# Altium schematic sheet modulo_temperatura.SchDoc
size A4; SheetNumber: 1; SheetTotal: 1
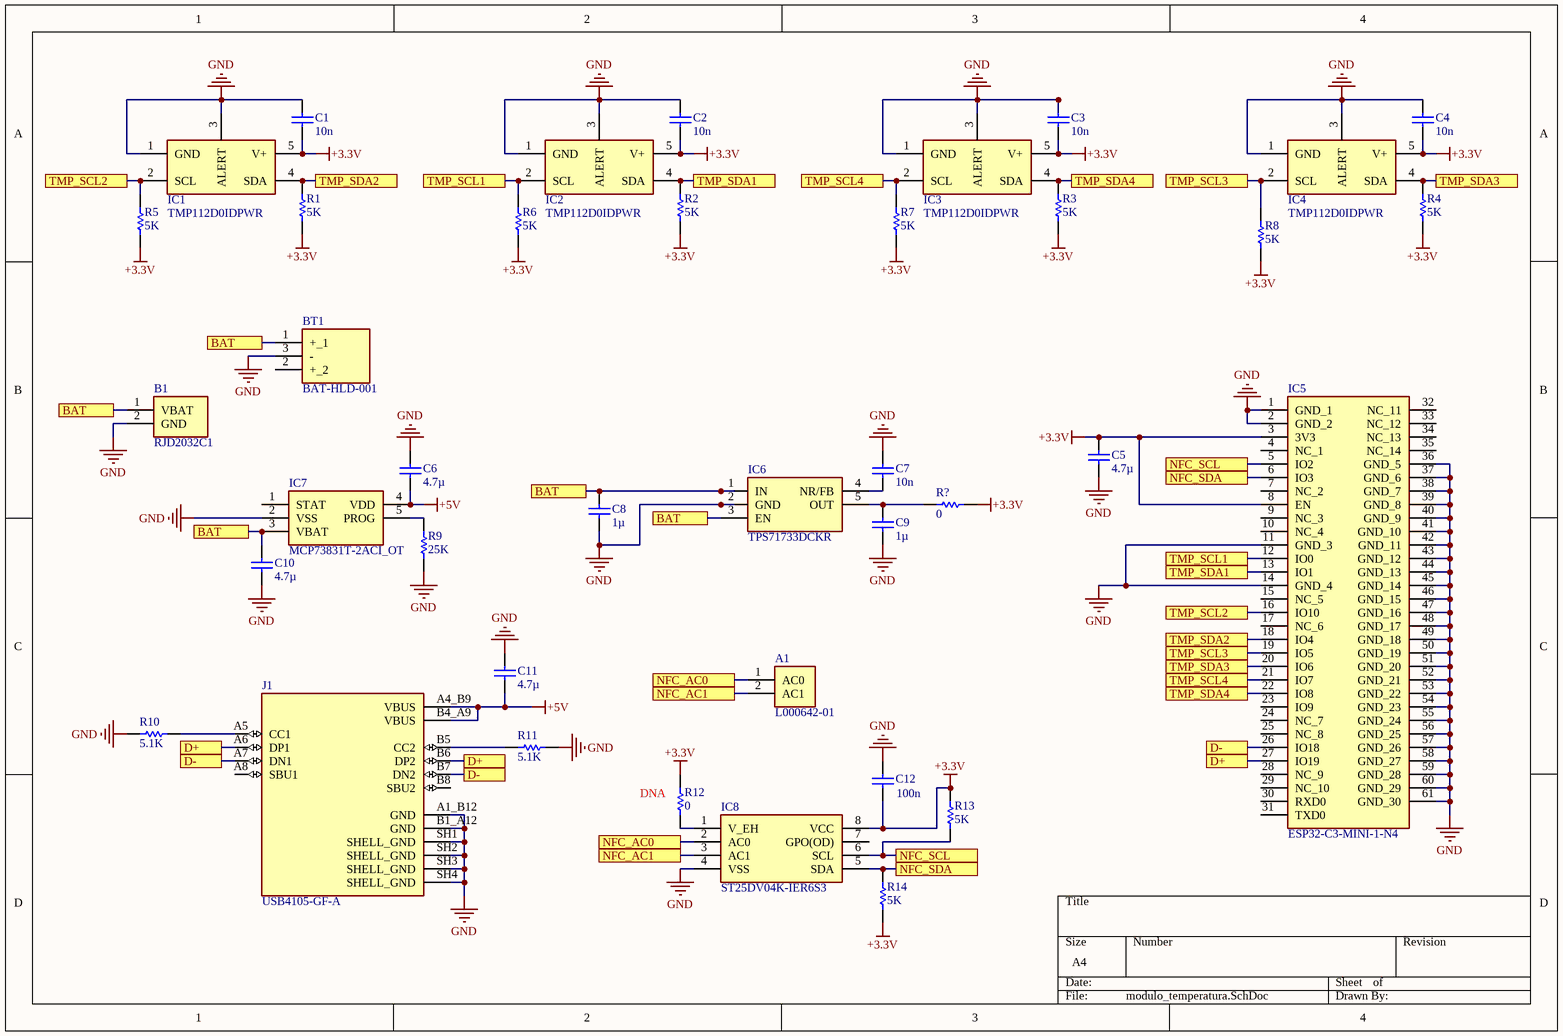
[diagram p0: modulo_temperatura.SchDoc]

## Parts
A1  L000642-01
B1  RJD2032C1
BT1  BAT-HLD-001  [BATHLD001]
C1  value 10n  (hidden comment: Capacitor)
C2  value 10n  (hidden comment: Capacitor)
C3  value 10n  (hidden comment: Capacitor)
C4  value 10n  (hidden comment: Capacitor)
C5  value 4.7µ  (hidden comment: Capacitor)
C6  value 4.7µ  (hidden comment: Capacitor)
C7  value 10n  (hidden comment: Capacitor)
C8  value 1µ  (hidden comment: Capacitor)
C9  value 1µ  (hidden comment: Capacitor)
C10  value 4.7µ  (hidden comment: Capacitor)
C11  value 4.7µ  (hidden comment: Capacitor)
C12  value 100n  (hidden comment: Capacitor)
IC1  TMP112D0IDPWR
IC2  TMP112D0IDPWR
IC3  TMP112D0IDPWR
IC4  TMP112D0IDPWR
IC5  ESP32-C3-MINI-1-N4  [ESP32C3MINI1N4]
IC6  TPS71733DCKR  [SOT65P210X110-5N]
IC7  MCP73831T-2ACI_OT  [SOT95P270X145-5N]
IC8  ST25DV04K-IER6S3  [SOIC127P600X175-8N]
J1  USB4105-GF-A  [GCT_USB4105-GF-A]
R1  value 5K  (hidden comment: Resistor)
R2  value 5K  (hidden comment: Resistor)
R3  value 5K  (hidden comment: Resistor)
R4  value 5K  (hidden comment: Resistor)
R5  value 5K  (hidden comment: Resistor)
R6  value 5K  (hidden comment: Resistor)
R7  value 5K  (hidden comment: Resistor)
R8  value 5K  (hidden comment: Resistor)
R9  value 25K  (hidden comment: Resistor)
R10  value 5.1K  (hidden comment: Resistor)
R11  value 5.1K  (hidden comment: Resistor)
R12  value 0  (hidden comment: Resistor)
R13  value 5K  (hidden comment: Resistor)
R14  value 5K  (hidden comment: Resistor)
R?  value 0  (hidden comment: Resistor)

## Ports
BAT, D+, D-, NFC_AC0, NFC_AC1, NFC_SCL, NFC_SDA, TMP_SCL1, TMP_SCL2, TMP_SCL3, TMP_SCL4, TMP_SDA1, TMP_SDA2, TMP_SDA3, TMP_SDA4

## Nets
+3.3V: C1.1 C2.1 C3.1 C4.1 C5.2 C12.1 IC1.5(V+) IC2.5(V+) IC3.5(V+) IC4.5(V+) IC5.3(3V3) IC5.8(EN) IC8.8(VCC) R1.1 R2.1 R3.1 R4.1 R5.1 R6.1 R7.1 R8.1 R12.1 R13.1 R14.1 R?.2
+5V: C6.1 C11.2 IC7.4(VDD) J1.A4_B9(VBUS) J1.B4_A9(VBUS)
GND: B1.2(GND) BT1.3(-) C1.2 C2.2 C3.2 C4.2 C5.1 C6.2 C7.2 C8.1 C9.1 C10.1 C11.1 C12.2 IC1.1(GND) IC1.3(ALERT) IC2.1(GND) IC2.3(ALERT) IC3.1(GND) IC3.3(ALERT) IC4.1(GND) IC4.3(ALERT) IC5.1(GND_1) IC5.2(GND_2) IC5.11(GND_3) IC5.14(GND_4) IC5.36(GND_5) IC5.37(GND_6) IC5.38(GND_7) IC5.39(GND_8) IC5.40(GND_9) IC5.41(GND_10) IC5.42(GND_11) IC5.43(GND_12) IC5.44(GND_13) IC5.45(GND_14) IC5.46(GND_15) IC5.47(GND_16) IC5.48(GND_17) IC5.49(GND_18) IC5.50(GND_19) IC5.51(GND_20) IC5.52(GND_21) IC5.53(GND_22) IC5.54(GND_23) IC5.55(GND_24) IC5.56(GND_25) IC5.57(GND_26) IC5.58(GND_27) IC5.59(GND_28) IC5.60(GND_29) IC5.61(GND_30) IC6.2(GND) IC7.2(VSS) IC8.4(VSS) J1.A1_B12(GND) J1.B1_A12(GND) J1.SH1(SHELL_GND) J1.SH2(SHELL_GND) J1.SH3(SHELL_GND) J1.SH4(SHELL_GND) R9.1 R10.1 R11.1
BAT: B1.1(VBAT) BT1.1(+_1) C8.2 C10.2 IC6.1(IN) IC6.3(EN) IC7.3(VBAT) ; port BAT
D+: IC5.27(IO19) J1.A6(DP1) J1.B6(DP2) ; port D+
D-: IC5.26(IO18) J1.A7(DN1) J1.B7(DN2) ; port D-
NFC_AC0: A1.1(AC0) IC8.2(AC0) ; port NFC_AC0
NFC_AC1: A1.2(AC1) IC8.3(AC1) ; port NFC_AC1
NFC_SCL: IC5.5(IO2) IC8.6(SCL) R13.2 ; port NFC_SCL
NFC_SDA: IC5.6(IO3) IC8.5(SDA) R14.2 ; port NFC_SDA
TMP_SCL1: IC2.2(SCL) IC5.12(IO0) R6.2 ; port TMP_SCL1
TMP_SCL2: IC1.2(SCL) IC5.16(IO10) R5.2 ; port TMP_SCL2
TMP_SCL3: IC4.2(SCL) IC5.19(IO5) R8.2 ; port TMP_SCL3
TMP_SCL4: IC3.2(SCL) IC5.21(IO7) R7.2 ; port TMP_SCL4
TMP_SDA1: IC2.4(SDA) IC5.13(IO1) R2.2 ; port TMP_SDA1
TMP_SDA2: IC1.4(SDA) IC5.18(IO4) R1.2 ; port TMP_SDA2
TMP_SDA3: IC4.4(SDA) IC5.20(IO6) R4.2 ; port TMP_SDA3
TMP_SDA4: IC3.4(SDA) IC5.22(IO8) R3.2 ; port TMP_SDA4
NetC7_1: C7.1 IC6.4(NR/FB)
NetC9_2: C9.2 IC6.5(OUT) R?.1
NetIC7_5: IC7.5(PROG) R9.2
NetIC8_1: IC8.1(V_EH) R12.2
NetJ1_A5: J1.A5(CC1) R10.2
NetJ1_B5: J1.B5(CC2) R11.2

Not connected (* = marked no-connect by the designer): BT1 2(+_2); IC5 4(NC_1) 7(NC_2) 9(NC_3) 10(NC_4) 15(NC_5) 17(NC_6) 23(IO9) 24(NC_7) 25(NC_8) 28(NC_9) 29(NC_10) 30(RXD0) 31(TXD0) 32(NC_11) 33(NC_12) 34(NC_13) 35(NC_14); IC7 1(STAT); IC8 7(GPO(OD)); J1 A8(SBU1) B8(SBU2)

## Notes on the sheet
- (near R12) DNA

## Library data of the parts
A1 = L000642-01: Antena NFC 13.56MHz
B1 = RJD2032C1: Bateria recarregável de íon-lítio CR2032
BT1 = BAT-HLD-001: Battery; Manufacturer_Name: TE Connectivity; Datasheet Link: https://www.te.com/commerce/DocumentDelivery/DDEController?Action=showdoc&DocId=Customer+Drawing%7FC-BAT-HLD-001-xx%7FE%7Fpdf%7FEnglish%7FENG_CD_C-BAT-HLD-001-xx_E.pdf%7FBAT-HLD-001; Height: 4.3mm; Manufacturer_Part_Number: BAT-HLD-001; Mouser Part Number: 712-BAT-HLD-001; Mouser Price/Stock: https://www.mouser.co.uk/ProductDetail/TE-Connectivity-Linx-Technologies/BAT-HLD-001?qs=K5ta8V%252BWhta7hbVGfm4dqA%3D%3D; Arrow Part Number: BAT-HLD-001; Arrow Price/Stock: https://www.arrow.com/en/products/bat-hld-001/te-connectivity?region=nac
C1-C4 C7 C12 = Capacitor: SimulationGenericComponent: True
C5 C6 C8-C11 = Capacitor: Capacitor / Cerâmico; SimulationGenericComponent: True
IC1-IC4 = TMP112D0IDPWR: Integrated Circuit
IC5 = ESP32-C3-MINI-1-N4: Integrated Circuit; Manufacturer_Name: Espressif Systems; Datasheet Link: https://www.mouser.com/datasheet/2/891/Espressif_ESP32_C3_MINI_1_Datasheet-2006822.pdf; Height: 2.55mm; Manufacturer_Part_Number: ESP32-C3-MINI-1-N4; Mouser Part Number: 356-ESP32-C3-MINI1N4; Mouser Price/Stock: https://www.mouser.co.uk/ProductDetail/Espressif-Systems/ESP32-C3-MINI-1-N4?qs=stqOd1AaK7%252B%2FpH3qqyGehA%3D%3D
IC6 = TPS71733DCKR: Integrated Circuit; Manufacturer_Name: Texas Instruments; Datasheet Link: http://www.ti.com/lit/gpn/tps717; Height: 1.1mm; Manufacturer_Part_Number: TPS71733DCKR; Mouser Part Number: 595-TPS71733DCKR; Mouser Price/Stock: https://www.mouser.co.uk/ProductDetail/Texas-Instruments/TPS71733DCKR?qs=QZuYiDxzHaicbGKtUrLzCQ%3D%3D; Arrow Part Number: TPS71733DCKR; Arrow Price/Stock: https://www.arrow.com/en/products/tps71733dckr/texas-instruments?region=nac
IC7 = MCP73831T-2ACI_OT: Integrated Circuit; Manufacturer_Name: Microchip; Manufacturer_Part_Number: MCP73831T-2ACI/OT; Datasheet Link: http://ww1.microchip.com/downloads/en/DeviceDoc/20001984g.pdf; Height: 1.45mm; Mouser Part Number: 579-MCP73831T-2ACIOT; Mouser Price/Stock: https://www.mouser.co.uk/ProductDetail/Microchip-Technology/MCP73831T-2ACI-OT?qs=yUQqVecv4qvbBQBGbHx0Mw%3D%3D; Arrow Part Number: MCP73831T-2ACI/OT; Arrow Price/Stock: https://www.arrow.com/en/products/mcp73831t-2aciot/microchip-technology?utm_currency=USD&region=nac
IC8 = ST25DV04K-IER6S3: Integrated Circuit; Manufacturer_Name: STMicroelectronics; Datasheet Link: https://ms.componentsearchengine.com/Datasheets/2/ST25DV04K-IER6S3.pdf; Height: 1.75mm; Manufacturer_Part_Number: ST25DV04K-IER6S3; Mouser Part Number: 511-ST25DV04K-IER6S3; Mouser Price/Stock: https://www.mouser.co.uk/ProductDetail/STMicroelectronics/ST25DV04K-IER6S3?qs=xjeEZJU9OeNdtP1j9447OQ%3D%3D; Arrow Part Number: ST25DV04K-IER6S3; Arrow Price/Stock: https://www.arrow.com/en/products/st25dv04k-ier6s3/stmicroelectronics?utm_currency=USD&region=europe
J1 = USB4105-GF-A: MF: {'manufacturer': u'GCT'}; Package: None; Price: None; Value: *; MP: USB4105-GF-A; Availability: Unavailable
R1-R11 R13 R14 = Resistor: TC1: 0; SimulationGenericComponent: True; TC2: 0
R12 R? = Resistor: SimulationGenericComponent: True; TC1: 0; TC2: 0